# Altium schematic sheet callisto-flight-computer.SchDoc
size A4; SheetNumber: 1; SheetTotal: 6
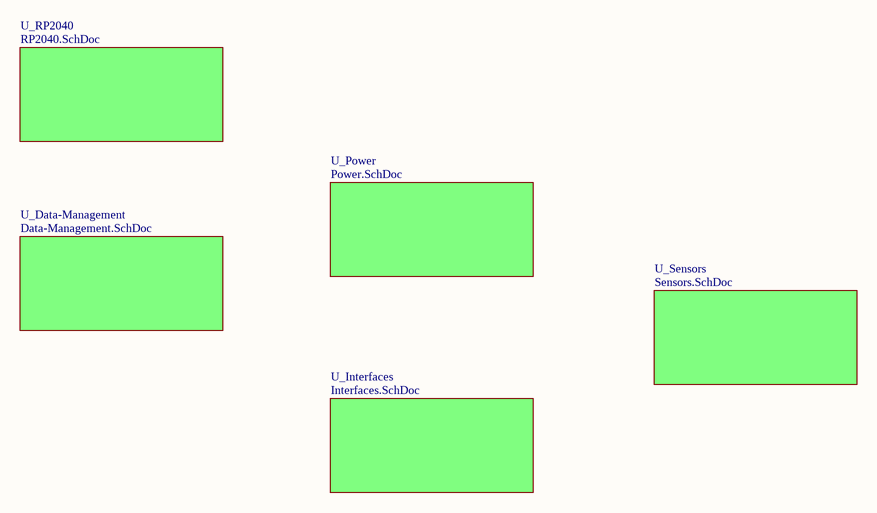
[diagram p0: callisto-flight-computer.SchDoc]

## Sub-sheets
U_Data-Management = Data-Management.SchDoc: no entries
U_Interfaces = Interfaces.SchDoc: no entries
U_Power = Power.SchDoc: no entries
U_RP2040 = RP2040.SchDoc: no entries
U_Sensors = Sensors.SchDoc: no entries